# Altium schematic sheet power.SchDoc
size A4; SheetNumber: 1; SheetTotal: 4
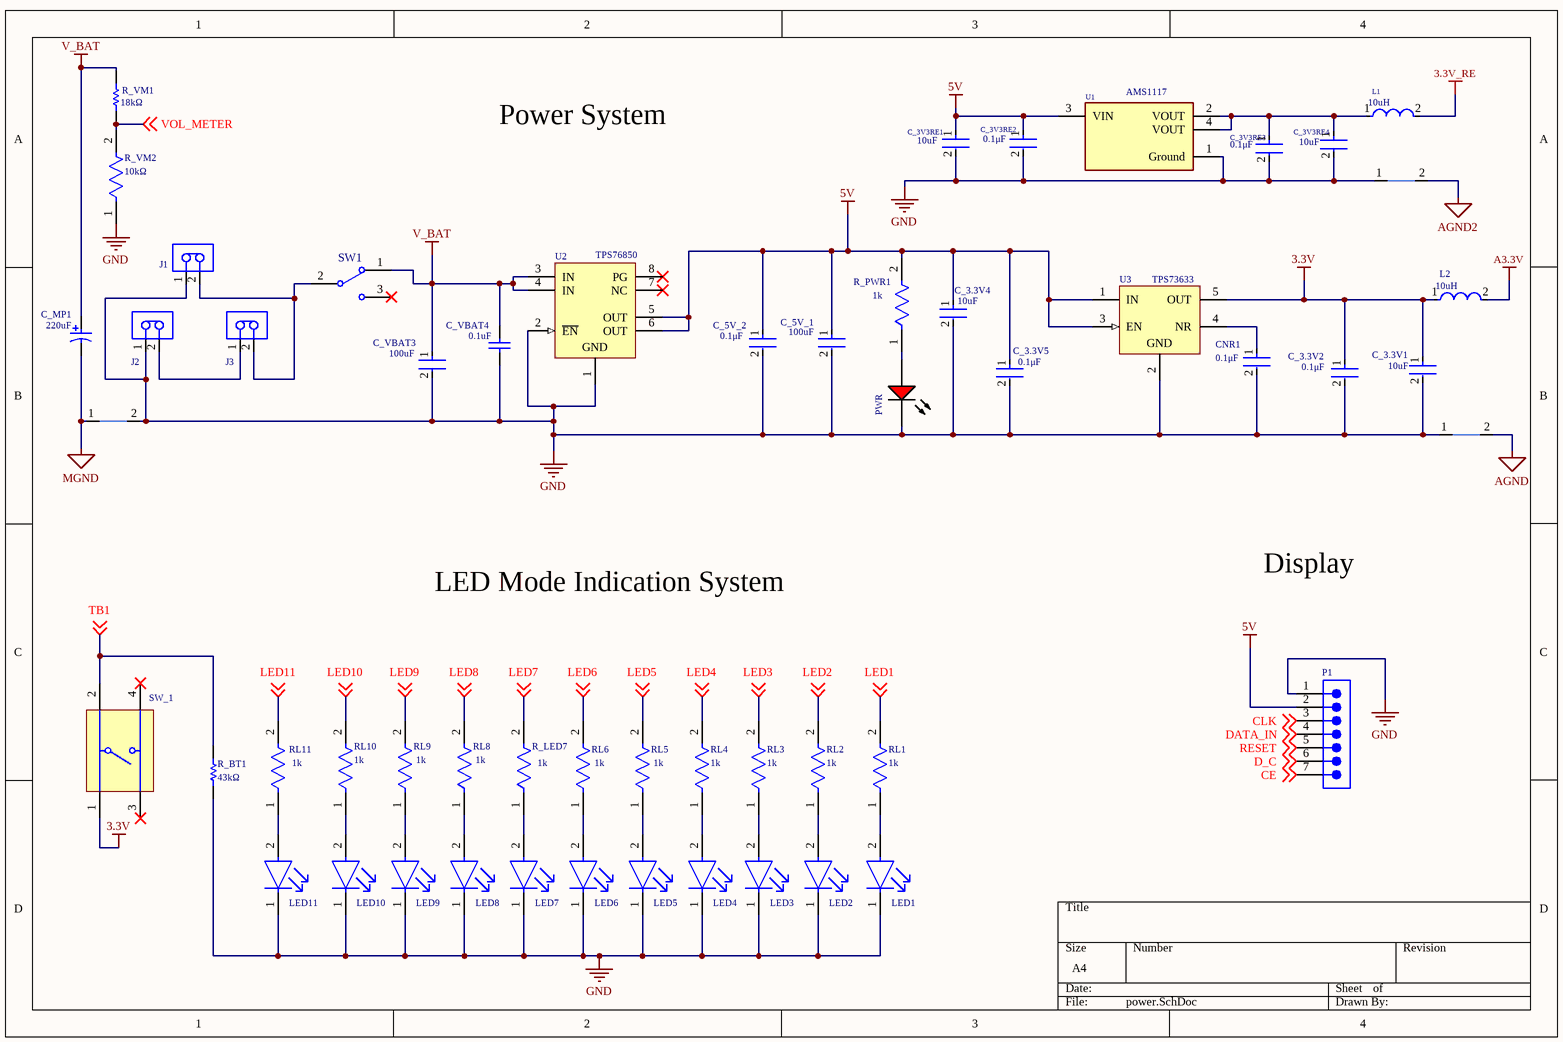
[diagram p0: power.SchDoc]

## Parts
C_3.3V1  value 10uF  [FP-C0805C-DG-MFG]  (hidden comment: C0805C106K8PACTU)
C_3.3V2  value 0.1μF  [FP-C0805C-DN-MFG]  (hidden comment: C0805C104J8RACTU)
C_3.3V4  value 10uF  [FP-C0805C-DG-MFG]  (hidden comment: C0805C106K8PACTU)
C_3.3V5  value 0.1μF  [FP-C0805C-DN-MFG]  (hidden comment: C0805C104J8RACTU)
C_3V3RE1  value 10uF  [FP-C0805C-DG-MFG]  (hidden comment: C0805C106K8PACTU)
C_3V3RE2  value 0.1μF  [FP-C0805C-DN-MFG]  (hidden comment: C0805C104J8RACTU)
C_3V3RE3  value 0.1μF  [FP-C0805C-DN-MFG]  (hidden comment: C0805C104J8RACTU)
C_3V3RE4  value 10uF  [FP-C0805C-DG-MFG]  (hidden comment: C0805C106K8PACTU)
C_5V_1  value 100uF  [FP-C1206C-EH-MFG]  (hidden comment: C1206C107M9PACTU)
C_5V_2  value 0.1μF  [FP-C0805C-DN-MFG]  (hidden comment: C0805C104J8RACTU)
C_MP1  value 220uF  [NIC-CAPA2-6.3X7.7_V]  (hidden comment: UUD1A221MCL1GS)
C_VBAT3  value 100uF  [FP-C1206C-EH-MFG]  (hidden comment: C1206C107M9PACTU)
C_VBAT4  value 0.1uF  [CAPC2013X145X50LL20T25]  (hidden comment: C0805C105K4PACTU)
CNR1  value 0.1μF  [FP-C0805C-DN-MFG]  (hidden comment: C0805C104J8RACTU)
J1  B2B-PH-K-S(LF)(SN)  [JST-B2B-PH-K-S_V]  (value not drawn)
J2  B2B-PH-K-S(LF)(SN)  [JST-B2B-PH-K-S_V]  (value not drawn)
J3  B2B-PH-K-S(LF)(SN)  [JST-B2B-PH-K-S_V]  (value not drawn)
L1  value 10uH  [FP-LB2012-1_25-0_2-MFG]  (hidden comment: LBR2012T100K)
L2  value 10uH  [FP-LB2012-1_25-0_2-MFG]  (hidden comment: LBR2012T100K)
LED1  SML-D12M1WT86  [FP-SML-D12-MFG]  (value not drawn)
LED2  SML-D12M1WT86  [FP-SML-D12-MFG]  (value not drawn)
LED3  SML-D12M1WT86  [FP-SML-D12-MFG]  (value not drawn)
LED4  SML-D12M1WT86  [FP-SML-D12-MFG]  (value not drawn)
LED5  SML-D12M1WT86  [FP-SML-D12-MFG]  (value not drawn)
LED6  SML-D12M1WT86  [FP-SML-D12-MFG]  (value not drawn)
LED7  SML-D12M1WT86  [FP-SML-D12-MFG]  (value not drawn)
LED8  SML-D12M1WT86  [FP-SML-D12-MFG]  (value not drawn)
LED9  SML-D12M1WT86  [FP-SML-D12-MFG]  (value not drawn)
LED10  SML-D12M1WT86  [FP-SML-D12-MFG]  (value not drawn)
LED11  SML-D12M1WT86  [FP-SML-D12-MFG]  (value not drawn)
NT1  NT  [NETTIE_SMD]  (value not drawn)  (net tie, no BOM)
NT2  NT  [NETTIE_SMD]  (value not drawn)  (net tie, no BOM)
NT3  NT  [NETTIE_SMD]  (value not drawn)  (net tie, no BOM)
P1  61300711121  [61300711121]  (value not drawn)
PWR  TLMS1100-GS08  [VISH-TLMX1100_V]  (value not drawn)
R_BT1  value 43kΩ  [RESC1608X55X30NL20T20]  (hidden comment: ERA3AEB433V)
R_LED7  value 1k  [FP-RC0603-0_55-IPC_C]  (hidden comment: RC0603FR-071KL)
R_PWR1  value 1k  [FP-RC0603-0_55-IPC_C]  (hidden comment: RC0603FR-071KL)
R_VM1  value 18kΩ  [RESC1608X55X30ML15T15]  (hidden comment: ERJ-3EKF2002V)
R_VM2  value 10kΩ  [FP-ERA3A-IPC_C]  (hidden comment: ERA-3AEB103V)
RL1  value 1k  [FP-RC0603-0_55-IPC_C]  (hidden comment: RC0603FR-071KL)
RL2  value 1k  [FP-RC0603-0_55-IPC_C]  (hidden comment: RC0603FR-071KL)
RL3  value 1k  [FP-RC0603-0_55-IPC_C]  (hidden comment: RC0603FR-071KL)
RL4  value 1k  [FP-RC0603-0_55-IPC_C]  (hidden comment: RC0603FR-071KL)
RL5  value 1k  [FP-RC0603-0_55-IPC_C]  (hidden comment: RC0603FR-071KL)
RL6  value 1k  [FP-RC0603-0_55-IPC_C]  (hidden comment: RC0603FR-071KL)
RL8  value 1k  [FP-RC0603-0_55-IPC_C]  (hidden comment: RC0603FR-071KL)
RL9  value 1k  [FP-RC0603-0_55-IPC_C]  (hidden comment: RC0603FR-071KL)
RL10  value 1k  [FP-RC0603-0_55-IPC_C]  (hidden comment: RC0603FR-071KL)
RL11  value 1k  [FP-RC0603-0_55-IPC_C]  (hidden comment: RC0603FR-071KL)
SW1  EG1218  [ESWI-EG1218_V]  (value not drawn)
SW_1  1825910-6  [TECO-1825910-6_V]  (value not drawn)
U1  value AMS1117  [FP-AMS1117-IPC_C]  (hidden comment: AMS1117-3.3)
U2  value TPS76850  [D0008A_N]  (hidden comment: TPS76850QDR)
U3  value TPS73633  [DBV0005A_L]  (hidden comment: TPS73633DBVR)

## Nets
3.3V: C_3.3V1.1 C_3.3V2.1 L2.1 SW_1.1 U3.5(OUT)
3.3V_RE: L1.2
5V: C_3.3V4.1 C_3.3V5.1 C_3V3RE1.1 C_3V3RE2.1 C_5V_1.1 C_5V_2.1 P1.2 R_PWR1.2 U1.3(VIN) U2.5(OUT) U2.6(OUT) U3.1(IN) U3.3(EN)
A3.3V: L2.2
AGND: NT2.2
AGND2: NT3.2
GND: C_3.3V1.2 C_3.3V2.2 C_3.3V4.2 C_3.3V5.2 C_3V3RE1.2 C_3V3RE2.2 C_3V3RE3.2 C_3V3RE4.2 C_5V_1.2 C_5V_2.2 C_VBAT3.2 C_VBAT4.1 CNR1.2 J1.1 J2.1 LED1.1(C) LED2.1(C) LED3.1(C) LED4.1(C) LED5.1(C) LED6.1(C) LED7.1(C) LED8.1(C) LED9.1(C) LED10.1(C) LED11.1(C) NT1.2 NT2.1 NT3.1 P1.1 PWR.2(K) R_BT1.1 R_VM2.1 U1.1(Ground) U2.1(GND) U2.2(~{EN}) U3.2(GND)
MGND: C_MP1.2 NT1.1
V_BAT: C_MP1.1 C_VBAT3.1 C_VBAT4.2 R_VM1.2 SW1.1 U2.3(IN) U2.4(IN)
CE: P1.7 ; off-sheet CE
CLK: P1.3 ; off-sheet CLK
D_C: P1.6 ; off-sheet D_C
DATA_IN: P1.4 ; off-sheet DATA_IN
LED1: RL1.2 ; off-sheet LED1
LED2: RL2.2 ; off-sheet LED2
LED3: RL3.2 ; off-sheet LED3
LED4: RL4.2 ; off-sheet LED4
LED5: RL5.2 ; off-sheet LED5
LED6: RL6.2 ; off-sheet LED6
LED7: R_LED7.2 ; off-sheet LED7
LED8: RL8.2 ; off-sheet LED8
LED9: RL9.2 ; off-sheet LED9
LED10: RL10.2 ; off-sheet LED10
LED11: RL11.2 ; off-sheet LED11
RESET: P1.5 ; off-sheet RESET
TB1: R_BT1.2 SW_1.2 ; off-sheet TB1
VOL_METER: R_VM1.1 R_VM2.2 ; off-sheet VOL_METER
NetC_3V3RE3_1: C_3V3RE3.1 C_3V3RE4.1 L1.1 U1.2(VOUT) U1.4(VOUT)
NetCNR1_1: CNR1.1 U3.4(NR)
NetJ1_2: J1.2 J3.2 SW1.2(COM)
NetJ2_2: J2.2 J3.1
NetLED1_2: LED1.2(A) RL1.1
NetLED2_2: LED2.2(A) RL2.1
NetLED3_2: LED3.2(A) RL3.1
NetLED4_2: LED4.2(A) RL4.1
NetLED5_2: LED5.2(A) RL5.1
NetLED6_2: LED6.2(A) RL6.1
NetLED7_2: LED7.2(A) R_LED7.1
NetLED8_2: LED8.2(A) RL8.1
NetLED9_2: LED9.2(A) RL9.1
NetLED10_2: LED10.2(A) RL10.1
NetLED11_2: LED11.2(A) RL11.1
NetPWR_1: PWR.1(A) R_PWR1.1

Not connected (* = marked no-connect by the designer): SW1 3*; SW_1 3* 4*; U2 7(NC)* 8(PG)*

## Notes on the sheet
- Power System
- Display
- LED Mode Indication System

## Library data of the parts
C_3.3V1 C_3.3V4 C_3V3RE1 C_3V3RE4 = CMP-2007-03243-2: CAP CER 10UF 10V X5R 0805; Manufacturer: Kemet; 3DS Part Number: 220-00001; Tolerance: 10%; Temperature Coefficient: 15%; Device Class L2: Capacitors; Device Class L1: Passive Components; ComponentLink2URL: https://content.kemet.com/datasheets/KEM_C1006_X5R_SMD.pdf; Height: 1.4mm; Lead Free: Yes; Manufacturer Part Number: C0805C106K8PACTU; Digikey Description: CAP CER 10UF 10V X5R 0805; Octopart: https://octopart.com/c0805c106k8pactu-kemet-98697; Capacitance: 10uF; Temperature Range Low: -55°C; Temperature: -55°C to +85°C; Automotive: No; Mouser Description: CAP CER 10UF 10V X5R 0805; Ipc Land Pattern Name: CAPC200125X125; Material: Ceramic; Temperature Range High: +85°C; Voltage: 10V; RoHS: TRUE; Device Class L3: Ceramic Capacitors; ComponentLink2Description: Datasheet; Voltage Rating: 10V; Package: C0805C-DG; Temperature Characteristic: X5R; Category: Cap
C_3.3V2 C_3.3V5 C_3V3RE2 C_3V3RE3 C_5V_2 CNR1 = CMP-03020-032188-1: CAP CER 0.1UF 10V 5% X7R 0805; Manufacturer: KEMET; Tolerance: 0.05; Capacitance: 0.10 μF; Temperature Coefficient: 30ppm/°C; Package: C0805C-DN; Device Class L1: Passive Components; Temperature: -55°C to +125°C; Category: Cap; RoHS: TRUE; Mouser Description: Multilayer Ceramic Capacitors MLCC - SMD/SMT 10volts 0.1uF X7R 5%; Lead Free: Yes; Temperature Range Low: -55°C; Material: Ceramic; Temperature Range High: +125°C; Device Class L2: Capacitors; Temperature Characteristic: X7R; Device Class L3: Ceramic Capacitors; ComponentLink2Description: Datasheet; Automotive: No; Ipc Land Pattern Name: CAPC200125X78; Manufacturer Part Number: C0805C104J8RACTU; Voltage Rating: 10 V; Height: 0.88mm; Digikey Description: CAP CER 0.1UF 10V 5% X7R 0805; Octopart: https://octopart.com/c0805c104j8ractu-kemet-11807087; ComponentLink2URL: https://content.kemet.com/datasheets/KEM_C1003_C0G_SMD.pdf
C_5V_1 C_VBAT3 = CMP-1037-05005-3: CAP CER 100UF 6.3V X5R 1206; Dielectric Material: Ceramic; Tolerance: 2%; Dissipation Factor: 5%; Min Operating Temperature: -55°C; Case Code (Imperial): 1206; Case Code (Metric): 3216; Depth: 1.6mm; Dielectric: X5R; Max Operating Temperature: 85°C; Packaging: Tape and Reel; Construction: Flat; Series: C; Case/Package: 1206; Radiation Hardening: No; Voltage Rating (DC): 6.3V; Termination: SMD/SMT; Voltage Rating: 6.3V; Capacitance: 100uF; Number of Pins: 2; RoHS Compliant: Yes; Height: 1.6mm; Lead Free: Lead Free; Voltage: 6.3V; REACH SVHC: No SVHC; Length: 3.2mm; Mount: Surface Mount; Package Quantity: 1; Thickness: 0.071inch; Width: 0.063inch
C_MP1 = CMP-0687-00055-1: Aluminum Electrolytic Capacitor, UD Series, Low Impedance, 220 uF, 10 V, + / - 20%, -55 to 105 degC, Chip Type, 6.3 x 7.7 mm D x L, Pb-Free, Reel; Manufacturer: Nichicon; Packing: Dia382mm Reel; Tolerance Rated Capacitance: -20 to 20%; Impedance: 0.34 Ohm; Rated Ripple Current (at 100kHz): 280 mA; Rated Voltage: 10 V; Rated Capacitance: 220 uF; Endurance Time: 2000 h; RoHS: TRUE; ComponentLink1URL: http://www.nichicon.co.jp/; ComponentLink2Description: Datasheet; ComponentLink2URL: http://products.nichicon.co.jp/en/pdf/XJA043/e-ud.pdf; Mounting Technology: Surface Mount; PartNumber: UUD1A221MCL1GS; DatasheetVersion: 08/2012; ComponentLink3URL: http://products.nichicon.co.jp/en/pdf/XJA043/e-ud.pdf; ComponentLink3Description: Package Specification; PackageReference: CAPAE-D6.3H7.7; Diameter: 6.3 mm; PackageDescription: 2-Pin Surface Mount Device, Diameter 6.3 mm, Height 7.7 mm, Pitch 5.4 mm; Length: 7.7 mm; ComponentLink1Description: Manufacturer URL
C_VBAT4 = CMP-1036-04746-2: Manufacturer: Kemet; Part Number: C0805C105K4PACTU
J1-J3 = CMP-2000-05162-1: Male Header, Pitch 2 mm, 1 x 2 Position, Height 6 mm, Tail Length 3.4 mm, -25 to 85 degC, RoHS, Bulk; Manufacturer: JST; Pitch: 2mm; Style/Orientation: StraightHeader/Plug; No of Positions: 2; Datasheet Version: Nov-08; Datasheet URL: http://datasheet.octopart.com/B2B-PH-K-S%28LF%29%28SN%29-JST-datasheet-8324864.pdf; Manufacturer URL: http://www.jst.com/home2.html; Type: ShroudedHeader; Termination: Crimp
L1 L2 = CMP-14484-000421-1: SMD Inductors 10uH ±10% 0.15A 0.468Ω 0805; DC Current: 150mA; Core Material: Ferrite; Shielding: Unshielded; Test Frequency: 2.52MHz; DC Resistance (DCR): 360mR; Self Resonant Frequency: 32MHz; Military Standard: Not; Termination: SMD/SMT; Height - Seated (Max): 0.057inch; Current Rating: 150mA; Tolerance: 10%; Case Code (Imperial): 0805; Radiation Hardening: No; Inductance: 10uH; Resistor Type: Wirewound; Length: 0.079inch; Weight: 0.000194oz; Case Code (Metric): 2012; Max Operating Temperature: 105°C; Height: 1.6mm; Packaging: Tape and Reel; Lead Pitch: 1mm; Case/Package: 0805; Depth: 1.45mm; Series: LB; Mount: Surface Mount; Min Operating Temperature: -40°C; Inductance Tolerance: 10%; RoHS Compliant: Yes; Max DC Current: 150mA; Package Quantity: 3000; Lead Free: Lead Free; Width: 1.6mm; Halogen Free: Halogen Free
LED1-LED11 = CMP-08952-000005-1: LED YLW/GREEN DIFFUSED 1608 SMD; Manufacturer: Rohm; Led Orientation: Top View; Forward Voltage: 2.2V; Power Dissipation: 54mW; Wavelength: 572nm; Colour: Green; Reverse Voltage: 5V; Forward Current: 20mA; Luminous Intensity: 30mcd; Manufacturer Part Number: SML-D12M1WT86; RoHS: TRUE; Package: SML-D12; Temperature Range Low: -40°C; Device Class L3: unset; Temperature Range High: +85°C; Device Class L2: LEDs; Category: Diode; Device Class L1: Optoelectronics; Digikey Description: LED YLW/GREEN DIFFUSED 1608 SMD; Temperature: -40°C to +85°C; ComponentLink2Description: Datasheet; Automotive: No; Height: 0.65mm; Lead Free: Yes; Octopart: https://octopart.com/sml-d12m1wt86-rohm-70837112; ComponentLink2URL: https://www.rohm.com/datasheet/SML-D12M1W
NT1-NT3 = NetTie_SMD: Net Tie; type: NetI
P1 = CMP-1502-01074-2: NexarPartId: 32855531; Pitch: 2.54mm; Connector Type: Male Pin; Gender: Male; Current Rating: 3A; Contact Resistance: 20mΩ; Operating Supply Voltage: 250V; Number of Contacts: 7; REACH SVHC: Unknown; Termination: Solder; Contact Plating: Gold; Lead Pitch: 2.54mm; Contact Mating Length: 5.9944mm; RoHS: Compliant; Packaging: Bulk; Mount: Through Hole; Color: Black; Number of Pins: 7; Contact Material: Copper; Number of Rows: 1; Orientation: Vertical; Number of Positions: 7
PWR = CMP-1666-00027-1: LED, RED, 2.1 V, -40 to 100 degC, 2-Pin SMD (0603), RoHS, Tape and Reel; Type (Capacitors): C0G; Resistance: 100000000000 Ohm; Capacitance: 12 pF; Voltage Rating: 50 V; Tolerance: 5%; Min Operating Temperature: -55degC; REACH SVHC: No SVHC; ComponentLink2Description: Datasheet; ComponentLink1URL: http://www.vishay.com/; Width: 0.8 mm; Package Quantity: 4000; PackageReference: TLMX1100; ComponentLink2URL: http://www.vishay.com/docs/83173/tlmb1100.pdf; Case/Package: 0603; Case Code (Metric): 1608; Packaging: Tape and Reel; Pins: 2; ComponentLink1Description: Manufacturer URL; Max Operating Temperature: 125degC; Height: 0.8 mm; Length: 1.6 mm; Mount: Surface Mount; PackageDescription: 2-Pin Surface Mount Device, Body 1.6 x 0.8 mm; DatasheetVersion: Rev. 2.7, 03/2016; Case Code (Imperial): 0603; Voltage Rating (DC): 50 V; RoHSCompliant: True; Radiation Hardening: No
R_BT1 = CMP-2000-00064-1: Manufacturer: Panasonic; Part Number: ERA3AEB433V; Resistance: 43kΩ
R_LED7 R_PWR1 RL1-RL6 RL8-RL11 = CMP-1659-00009-5: RES 1K OHM 1% 1/10W 0603; Resistance: 1kR; Voltage Rating: 50V; Power Rating: 100mW; Temperature Coefficient: 100ppm/°C; Military Standard: Not; REACH SVHC: No SVHC; Size Code: 0603; Features: Moisture Resistant; Number of Terminations: 2; Technology: THICK FILM; Series: RC; Case Code (Metric): 1608; Resistance Tolerance: 1%; Resistor Type: Thick Film; Termination: SMD/SMT; Contact Plating: Tin; Radiation Hardening: No; Min Operating Temperature: -55°C; Max Operating Temperature: 155°C; Packaging: Tape and Reel; Max Power Dissipation: 100mW; RoHS Compliant: Yes; Height: 0.45mm; Lead Free: Lead Free; Case/Package: 0603; Length: 1.6mm; Tolerance: 1%; Case Code (Imperial): 0603; Construction: Rectangular; Depth: 0.8mm
R_VM1 = CMP-2000-00318-1: Manufacturer: Panasonic; Resistor: 20kΩ; Part Number: ERJ-3EKF2002V
R_VM2 = CMP-2000-00874-2: RES SMD 10K OHM 0.1% 1/10W 0603; Voltage Rating (DC): 75V; Power Rating: 100mW; Resistance: 10kR; Temperature Coefficient: 25ppm/°C; Radiation Hardening: No; Width: 0.8mm; Depth: 0.8mm; Construction: Rectangular; Case Code (Metric): 1608; Package Quantity: 5000; Length: 1.6mm; Size Code: 0603; Case Code (Imperial): 0603; Termination: SMD/SMT; Contact Plating: Tin; Resistance Tolerance: 0.1%; Military Standard: Not; Packaging: Tape and Reel; Max Power Dissipation: 100mW; REACH SVHC: No SVHC; Series: ERA-3A; Voltage Rating: 75V; Lead Free: Lead Free; Technology: METAL FILM; RoHS Compliant: Yes; Max Operating Temperature: 155°C; Resistor Type: Thin Film; Min Operating Temperature: -55°C; Number of Pins: 2; Case/Package: 0603; Tolerance: 0.1%; Height: 0.45mm; Mount: Surface Mount; Number of Terminations: 2
SW1 = CMP-1696-00002-1: Slide Switch, 500 V, -20 to 70 degC, 3-Pin THD, RoHS; Case\Package: SOT-23-5; Output Current: 150 mA; Nominal Output Voltage: 3.3 V; Max Power Dissipation: 250 mW; Min Input Voltage: 4.3 V; Outputs: 1; Max Input Voltage: 8 V; Dropout Voltage: 300 mV; PackageDescription: 3-Pin Through Hole Device, Body 11.6 x 4 mm, Pitch 2.5 mm; ComponentLink1URL: http://www.e-switch.ch/en/; RoHSCompliant: true; Length: 3 mm; ComponentLink1Description: Manufacturer URL; Power Rating: 250 mW; Mount: Surface Mount; Max Operating Temperature: 85 degC; REACH SVHC: No SVHC; Radiation Hardening: No; Height: 1.3 mm; Pins: 5; Max Ouput Current: 150 mA; Output Voltage: 3.3 V; Width: 1.8 mm; Package Quantity: 3000; ComponentLink2URL: https://www.e-switch.com/system/asset/product_line/data_sheet/119/EG.pdf; Min Operating Temperature: -40 degC; ComponentLink2Description: Datasheet; DatasheetVersion: Oct-15; PackageReference: EG1218; Packaging: Tape and Reel
SW_1 = CMP-1684-00021-1: Tact Switch, SPST-NO, 0.05 A, -35 to 85 degC, 4-Pin THD, RoHS, Bulk; Manufacturer: TE Connectivity; Maximum Contact Resistance: 100mOhm; Mechanical Life: 100000Cycles; Bushing Type: Unthreaded; Switch Configuration: OFF(ON); Maximum DC Voltage Rating: 24V; Contact Rating @ Voltage: 0.05A@24VDC; Actuator Color: Black; Body Orientation: Straight; Function: MomentaryContact; Illumination: N/R; Actuator Style: RoundButton; Actuator Material: PolybutyleneTerephthalate; Dielectric Strength: 500VAC; Pole Throw Configuration: SPST; Actuator Length: 1.4mm; Product Weight: N/A; Contact Material: CopperAlloy; Housing Material: N/A; Terminal Type: PCPins; Minimum Insulation Resistance: 100MOhm; Package Description: 4-Pin Through Hole Device, Body 5.99 x 5.99 mm, Pitch 6.5 mm; Part No: 1825910-6; Package Reference: THD; Base Material: N/A; Manufacturer URL: http://www.te.com; Contact Plating: Silver; RoHS: Yes; Datasheet Version: Rev. C9; Electrical Life: 100000Cycles; Maximum AC Voltage Rating: N/A; Thread Size: N/R; Operating Temperature: -35to85C; Mounting: ThroughHole; Dimension: 5.99x5mm; Datasheet URL: http://www.te.com/commerce/DocumentDelivery/DDEController?Action=showdoc&DocId=Customer+Drawing%7F1825910%7FC9%7Fpdf%7FEnglish%7FENG_CD_1825910_C9.pdf%7F1825910-6; Family: 1825910; Seal Location: N/A; Seal Description: N/A; Packaging: N/A
U1 = CMP-209535-000001-1: LDO Voltage Regulators 1A, 3.3V; Manufacturer: Advanced Monolithic Systems; Dropout Voltage: 1.1V; Output Type: Fixed; Nominal Supply Current: 5mA; Max Power Dissipation: 1.2W; Max Supply Voltage: 15V; Number Of Outputs: 1; Standoff Height: 0.64mm; Max Junction Temp: +125°C; Height: 1.8mm; Package: AMS1117; Device Class L2: Power Management ICs; ComponentLink2Description: Datasheet; ComponentLink2URL: http://www.advanced-monolithic.com/pdf/ds1117.pdf; Category: IC; RoHS: TRUE; Automotive: No; Device Class L1: Integrated Circuits (ICs); Output Current: 1A; Device Class L3: Voltage Regulators - Linear; Temperature: -40°C to +125°C; Output Voltage: 3.3V; Manufacturer Part Number: AMS1117-3.3; Temperature Range Low: -40°C; Octopart: https://octopart.com/ams1117-3.3-advanced+monolithic+systems-25899300; Lead Free: Yes; Ipc Land Pattern Name: SOT229P700X180-4; Temperature Range High: +125°C
U2 = CMP-0395-00088-2: Single Output Fast Transient Response LDO, 1 A, Fixed 5 V Output, 2.7 to 10 V Input, with Low IQ, 8-pin SOIC (D), -40 to 125 degC, Green (RoHS & no Sb/Br); Manufacturer: Texas Instruments; Iout(Max)(A): 1; Vout Adj(Max)(V): 5; Power Good: TRUE; Vin(Max)(V): 10; Accuracy(%): 2; Vdo(Typ)(mV): 230; Iq(Typ)(mA): 0.08; Vin(Min)(V): 2.7; SubFamily: Single Channel LDO; PackageDescription: 8-Pin Plastic Small Outline, Body 4.9 x 3.9 mm, Pitch 1.27 mm; Mounting Technology: Surface Mount; DatasheetVersion: SLVS211L; Eco-Plan: Green (RoHS & no Sb/Br); ComponentLink1Description: Manufacturer URL; ComponentLink1URL: http://www.ti.com/; PackageVersion: 4040047-3/M; ComponentLink3Description: Package Specification; PartNumber: TPS76850QDR; ComponentLink2Description: Datasheet; PackageReference: D0008A; ComponentLink3URL: http://www.ti.com/litv/pdf/msoi002j; Vout Adj(Min)(V): 5; ComponentLink2URL: http://www.ti.com/general/docs/lit/getliterature.tsp?genericPartNumber=TPS76850&fileType=pdf; Code_JEDEC: MS-012; Fixed Output Options(V): 5
U3 = CMP-0395-00256-2: Single Output Low Noise LDO, 400 mA, Fixed 3.3 V Output, 1.7 to 5.5 V Input, with Reverse Current Protection, 5-pin SOT-23 (DBV), -40 to 85 degC, Green (RoHS & no Sb/Br); Manufacturer: Texas Instruments; Vin(Min)(V): 1.7; Vdo(Typ)(mV): 75; Iq(Typ)(mA): 0.3; SubFamily: Single Channel LDO; Vout Adj(Max)(V): 3.3; Accuracy(%): 1; Vin(Max)(V): 5.5; Iout(Max)(A): 0.4; Rating: Catalog; ComponentLink1Description: Manufacturer URL; PartNumber: TPS73633DBVR; PackageDescription: 5-Pin Plastic Small Outline, Body 1.60 Ãƒâ€” 2.90 mm, Pitch 0.95 mm; ComponentLink3URL: http://www.ti.com/litv/pdf/mpds018i; ComponentLink2Description: Datasheet; ComponentLink4Description: URL Link1; DatasheetVersion: SBVS038T; Vout Adj(Min)(V): 3.3; Code_JEDEC: MO-178; Fixed Output Options(V): 3.3; Eco-Plan: Green (RoHS & no Sb/Br); PackageReference: DBV0005A; ComponentLink4URL: Samples URL:http://www.ti.com/product/tps73633#samples; PackageVersion: 4073253-4/K; ComponentLink2URL: http://www.ti.com/general/docs/lit/getliterature.tsp?genericPartNumber=TPS73633&fileType=pdf; ComponentLink1URL: http://www.ti.com/; ComponentLink3Description: Package Specification; Mounting Technology: Surface Mount